# EAGLE design Modem_V3 (EAGLE 7.2.0)
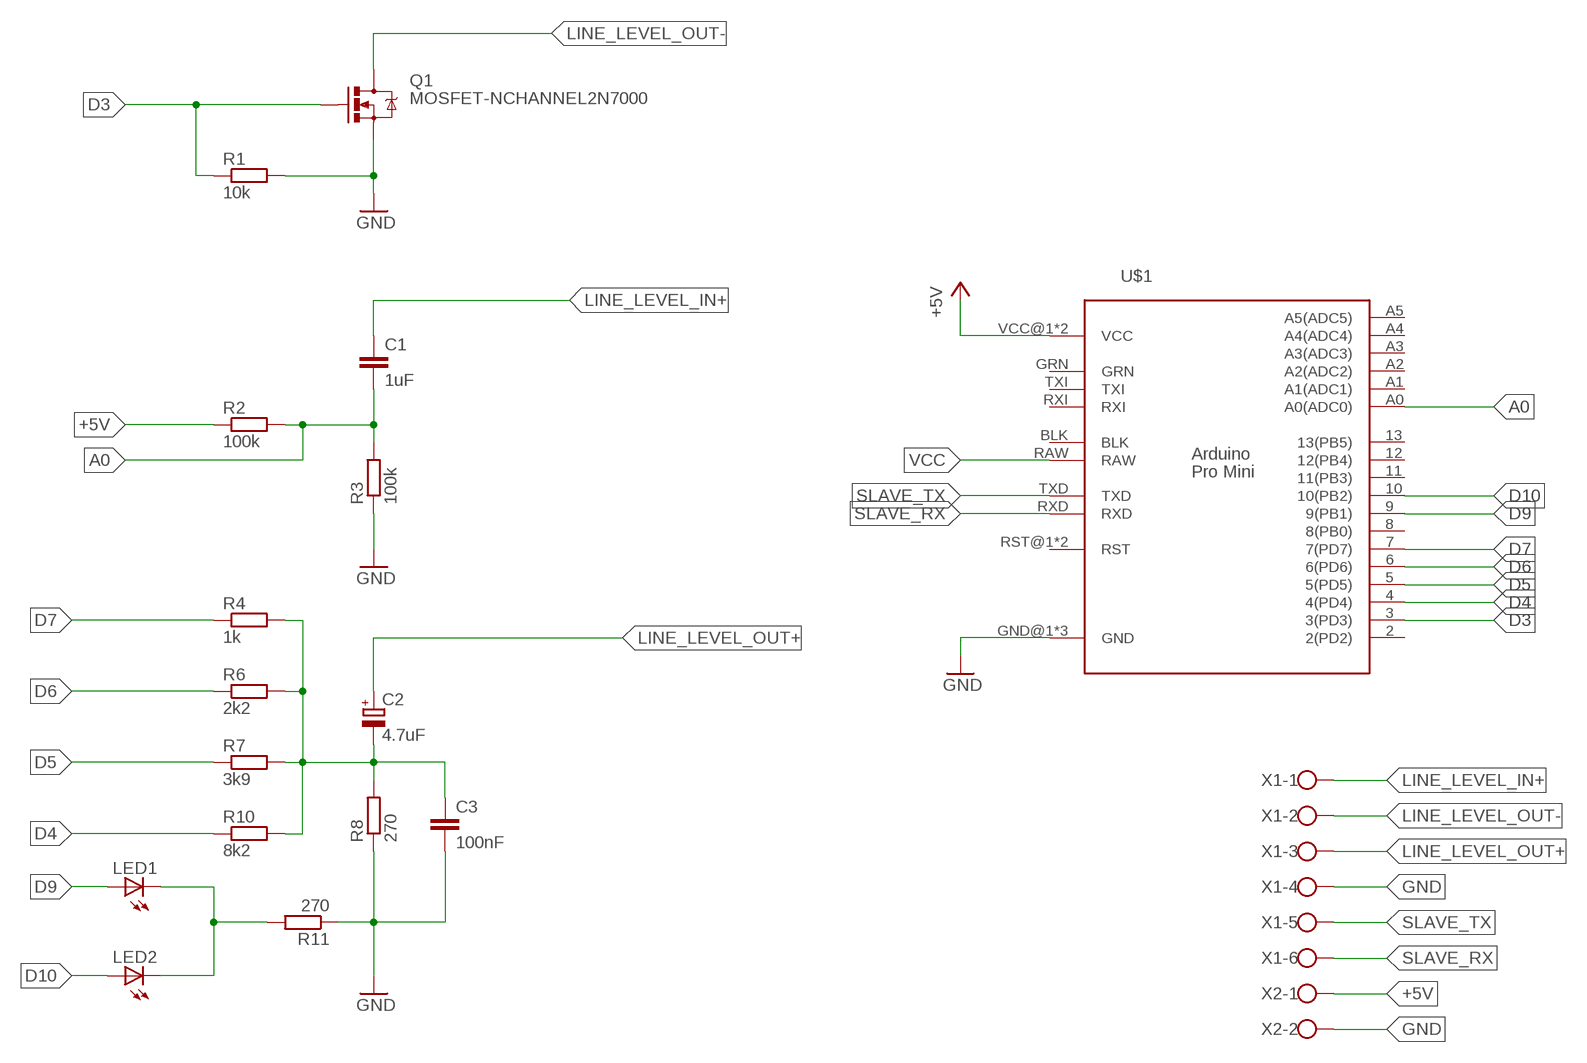
[diagram p0: schematic, sheet 1]

## Parts
C1  1uF  C-EU025-030X050  [C025-030X050]
C2  4.7uF  CPOL-EUE2.5-6  [E2,5-6]
C3  100nF  C-EU025-030X050  [C025-030X050]
LED1  LED5MM  [LED5MM]
LED2  LED5MM  [LED5MM]
Q1  MOSFET-NCHANNEL2N7000  [TO-92]
R1  10k  R-EU_0207/2V  [0207/2V]
R2  100k  R-EU_0207/2V  [0207/2V]
R3  100k  R-EU_0207/2V  [0207/2V]
R4  1k  R-EU_0207/2V  [0207/2V]
R6  2k2  R-EU_0207/2V  [0207/2V]
R7  3k9  R-EU_0207/2V  [0207/2V]
R8  270  R-EU_0207/2V  [0207/2V]
R10  8k2  R-EU_0207/2V  [0207/2V]
R11  270  R-EU_0207/2V  [0207/2V]
U$1  PRO-MINI  [PRO-MINI]
X1  W237-6  [W237-6]
X2  W237-102  [W237-102]

## Nets
+5V: R2.1 U$1.VCC@1(VCC) U$1.VCC@2(VCC) X2.1
A0: C1.2 R2.2 R3.2 U$1.A0(A0(ADC0))
D3: Q1.2(G) R1.1 U$1.3(3(PD3))
D4: R10.1 U$1.4(4(PD4))
D5: R7.1 U$1.5(5(PD5))
D6: R6.1 U$1.6(6(PD6))
D7: R4.1 U$1.7(7(PD7))
D9: LED1.A U$1.9(9(PB1))
D10: LED2.A U$1.10(10(PB2))
GND: C3.2 Q1.1(S) R1.2 R3.1 R8.1 R11.1 U$1.GND@1(GND) U$1.GND@2(GND) U$1.GND@3(GND) X1.4 X2.2
LINE_LEVEL_IN+: C1.1 X1.1
LINE_LEVEL_OUT+: C2.+ X1.3
LINE_LEVEL_OUT-: Q1.3(D) X1.2
N$8: LED1.K(C) LED2.K(C) R11.2
N$9: C2.- C3.1 R4.2 R6.2 R7.2 R8.2 R10.2
SLAVE_RX: U$1.RXD X1.6
SLAVE_TX: U$1.TXD X1.5
VCC: U$1.RAW
Unconnected: U$1.2(2(PD2)) U$1.8(8(PB0)) U$1.11(11(PB3)) U$1.12(12(PB4)) U$1.13(13(PB5)) U$1.A1(A1(ADC1)) U$1.A2(A2(ADC2)) U$1.A3(A3(ADC3)) U$1.A4(A4(ADC4)) U$1.A5(A5(ADC5)) U$1.BLK U$1.GRN U$1.RST@1(RST) U$1.RST@2(RST) U$1.RXI U$1.TXI

## Library data of the parts
C1 C3 = resistor:C-EU: CAPACITOR, European symbol
C2 = resistor:CPOL-EU: POLARIZED CAPACITOR, European symbol
LED1 LED2 = led:LED: LED OSRAM: - CHIPLED LG R971, LG N971, LY N971, LG Q971, LY Q971, LO R971, LY R971 LH N974, LH R974 LS Q976, LO Q976, LY Q976 LO Q996 - Hyper CHIPLED LW Q18S LB Q993, LB Q99A, LB R99A - SideLED LS A670, LO A670, LY A670, LG A670, LP A670 LB A673, LV A673, LT A673, LW A673 LH A674 LY A675 LS A676, LA A676, LO A676, LY A676, LW A676 LS A679, LY A679, LG A679 - Hyper Micro SIDELED® LS Y876, LA Y876, LO Y876, LY Y876 LT Y87S - SmartLED LW L88C, LW L88S LB L89C, LB L89S, LG L890 LS L89K, LO L89K, LY L89K LS L896, LA L896, LO L896, LY L896 - TOPLED LS T670, LO T670, LY T670, LG T670, LP T670 LSG T670, LSP T670, LSY T670, LOP T670, LYG T670 LG T671, LOG T671, LSG T671 LB T673, LV T673, LT T673, LW T673 LH T674 LS T676, LA T676, LO T676, LY T676, LB T676, LH T676, LSB T676, LW T676 LB T67C, LV T67C, LT T67C, LS T67K, LO T67K, LY T67K, LW E67C LS E67B, LA E67B, LO E67B, LY E67B, LB E67C, LV E67C, LT E67C LW T67C LS T679, LY T679, LG T679 LS T770, LO T770, LY T770, LG T770, LP T770 LB T773, LV T773, LT T773, LW T773 LH T774 LS E675, LA E675, LY E675, LS T675 LS T776, LA T776, LO T776, LY T776, LB T776 LHGB T686 LT T68C, LB T68C - Hyper Mini TOPLED® LB M676 - Mini TOPLED Santana® LG M470 LS M47K, LO M47K, LY M47K Source: http://www.osram.convergy.de LUXEON: - LUMILED® LXK2-PW12-R00, LXK2-PW12-S00, LXK2-PW14-U00, LXK2-PW14-V00 LXK2-PM12-R00, LXK2-PM12-S00, LXK2-PM14-U00 LXK2-PE12-Q00, LXK2-PE12-R00, LXK2-PE12-S00, LXK2-PE14-T00, LXK2-PE14-U00 LXK2-PB12-K00, LXK2-PB12-L00, LXK2-PB12-M00, LXK2-PB14-N00, LXK2-PB14-P00, LXK2-PB14-Q00 LXK2-PR12-L00, LXK2-PR12-M00, LXK2-PR14-Q00, LXK2-PR14-R00 LXK2-PD12-Q00, LXK2-PD12-R00, LXK2-PD12-S00 LXK2-PH12-R00, LXK2-PH12-S00 LXK2-PL12-P00, LXK2-PL12-Q00, LXK2-PL12-R00 Source: www.luxeon.com KINGBRIGHT: KA-3528ASYC Source: www.kingbright.com
Q1 = SparkFun-DiscreteSemi:MOSFET-NCHANNEL: Common NMOSFET Parts MFG P/N Store ID Prod ID FDD8780 TRANS-09984 SI7820DN TRANS-11055 FDS6630A IC-08089 2N7002PW TRANS-11151 FQP30N06L COM-10213 TRANS-10060 BSS123LT1G TRANS-08345 BSS138 TRANS-00830 BS170 2N7000
R1-R4 R6-R8 R10 R11 = resistor:R-EU_: RESISTOR, European symbol
U$1 = custom parts:PRO-MINI
X1 = con-wago-500:W237-6: WAGO SCREW CLAMP; OC_FARNELL: unknown; OC_NEWARK: unknown
X2 = con-wago-500:W237-102: WAGO SCREW CLAMP; MPN: 237-102; OC_FARNELL: unknown; OC_NEWARK: 70K9898

## Board
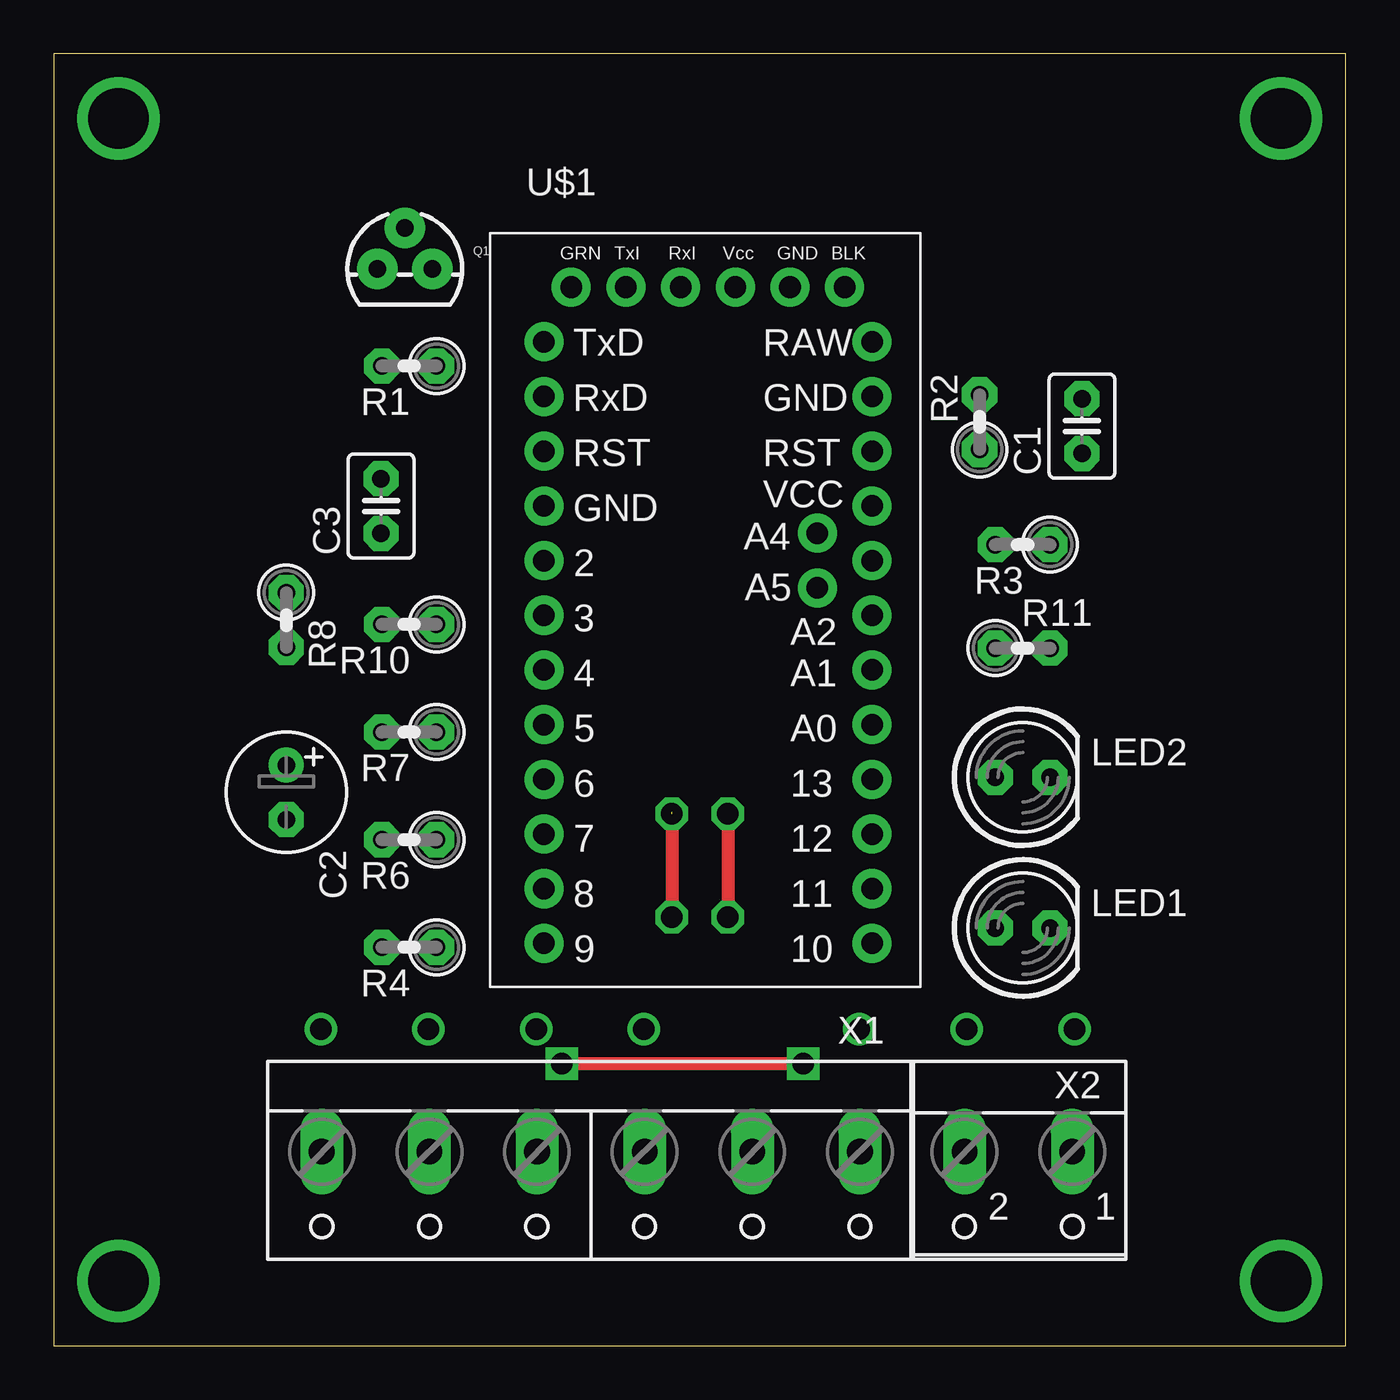
[diagram p1: board, top side]
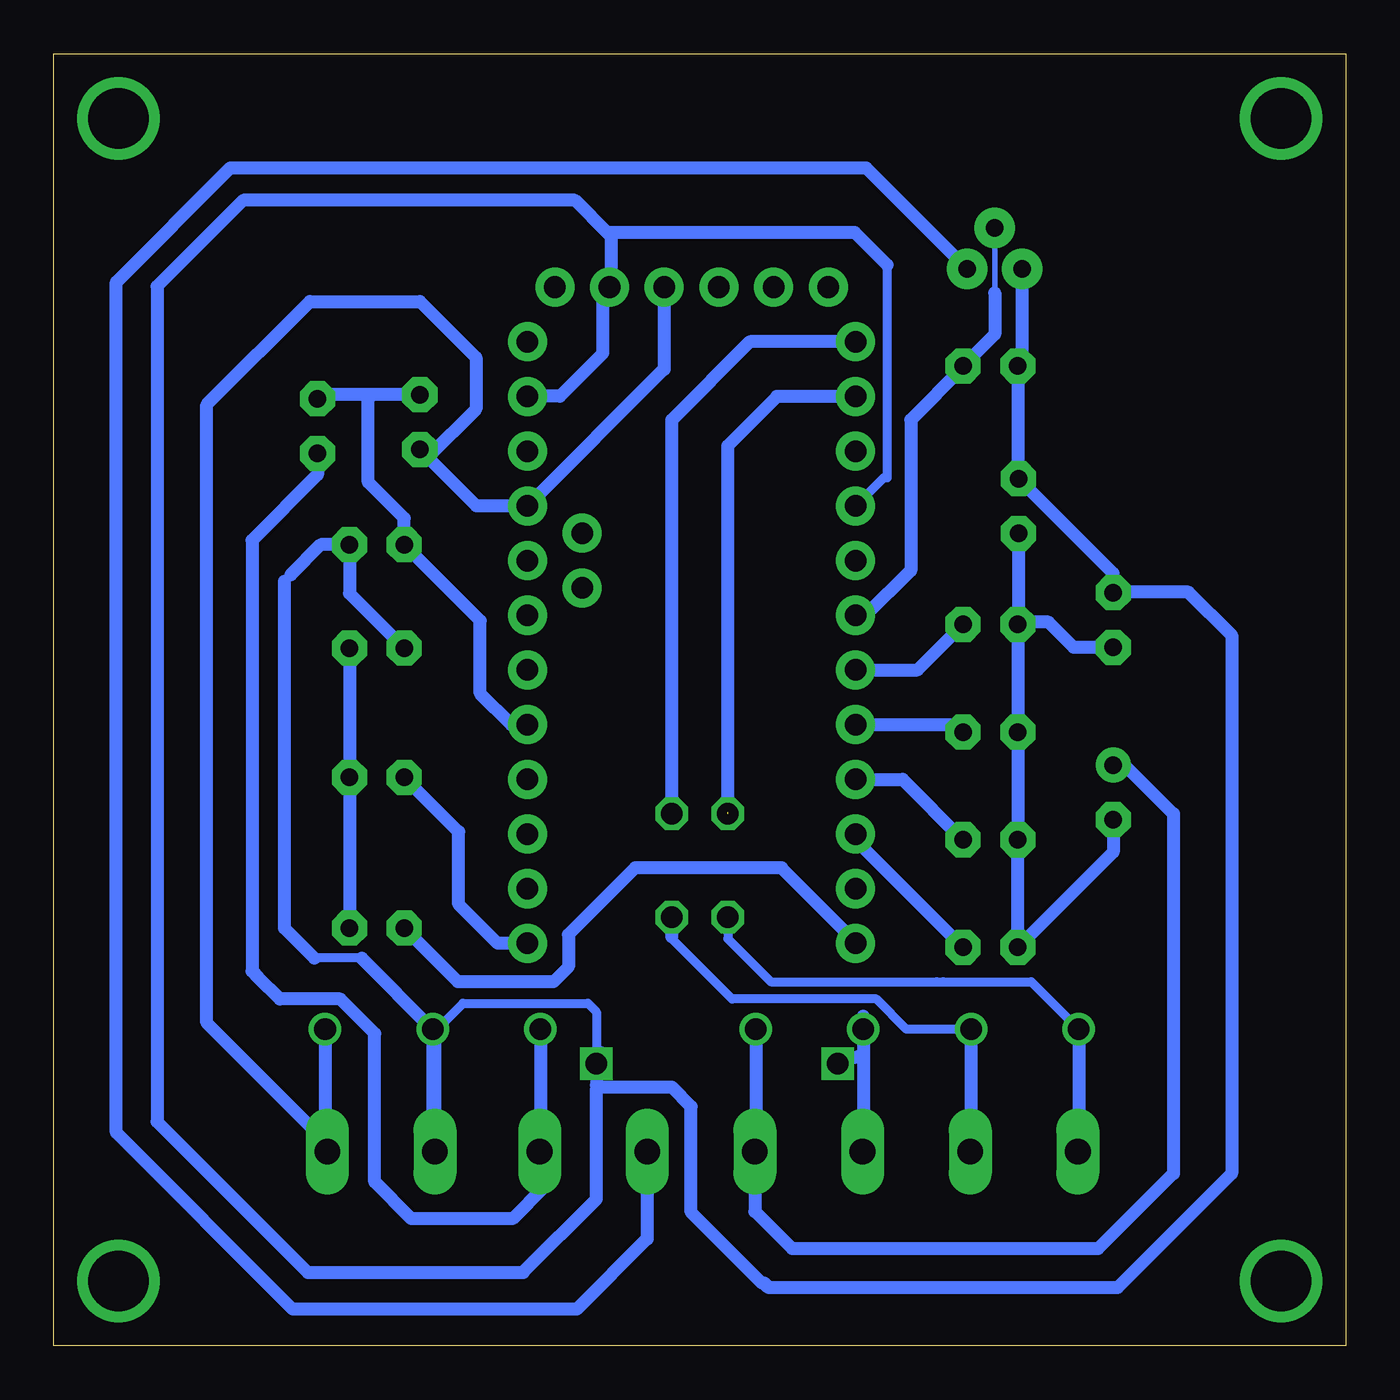
[diagram p2: board, bottom side, seen from below]

Size 60 x 60 mm. Coordinates in mm from the lower left corner, seen from the top.
Outline: 0,0 60,0 60,60 0,60 0,0
Copper layers (1*16): Top 0.035mm / dielectric 1.5mm / Bottom 0.035mm
Design rules "default": minimum track width 10mil, minimum drill 24mil, track to track 8mil, track to pad 8mil, pad to pad 8mil, via to via 8mil, smd to smd 8mil, copper to edge 40mil, drill to drill 8mil, minimum pad ring 16mil, minimum via ring 10mil, stop-mask expansion 4mil, vias tented up to drill 0mil, thermal gap 10mil

### Footprints (pad centres in the part's own frame; a part is rotated, then mirrored left to right if it is on the bottom)
C025-030X050 = drill 0.813 octagon: 1 -1.27,0; 2 1.27,0
E2,5-6 = drill 0.813 pad 1.6: + -1.27,0 | drill 0.813 pad 1.6 octagon: - 1.27,0
LED5MM = drill 0.813 octagon: A -1.27,0; K 1.27,0
TO-92 = drill 0.813 pad 1.88: 1 -1.27,0; 2 0,1.905; 3 1.27,0
0207/2V = drill 0.813 octagon: 1 -1.27,0; 2 1.27,0
PRO-MINI = drill 1: 2 2.48,19.794; 3 2.48,17.254; 4 2.48,14.714; 5 2.48,12.174; 6 2.48,9.634; 7 2.48,7.094; 8 2.48,4.554; 9 2.48,2.014; 10 17.72,2.014; 11 17.72,4.554; 12 17.72,7.094; 13 17.72,9.634; A0 17.72,12.174; A1 17.72,14.714; A2 17.72,17.254; A3 17.72,19.794; A4 15.18,21.064; A5 15.18,18.524; BLK 16.45,32.494; GND@1 2.48,22.334; GND@2 17.72,27.414; GND@3 13.91,32.494; GRN 3.75,32.494; RAW 17.72,29.954; RST@1 2.48,24.874; RST@2 17.72,24.874; RXD 2.48,27.414; RXI 8.83,32.494; TXD 2.48,29.954; TXI 6.29,32.494; VCC@1 17.72,22.334; VCC@2 11.37,32.494
W237-6 = drill 1.194 long: 1 -12.5,-1.27; 2 -7.5,-1.27; 3 -2.5,-1.27; 4 2.5,-1.27; 5 7.5,-1.27; 6 12.5,-1.27
W237-102 = drill 1.194 long: 1 -2.5,-1.27; 2 2.5,-1.27

### Placement (x,y rotation side)
C1  47.75,42.71 90 top
C2  10.8,25.7 270 top
C3  15.2,39 90 top
LED1  45,19.4 0 top
LED2  45,26.4 0 top
Q1  16.3,50 0 top
R1  16.5,45.5 180 top
R2  43,42.9 90 top
R3  45,37.2 180 top
R4  16.5,18.5 180 top
R6  16.5,23.5 180 top
R7  16.5,28.5 180 top
R8  10.8,33.7 270 top
R10  16.5,33.5 180 top
R11  45,32.4 0 top
U$1  20.28,16.67 0 top
X1  24.94,7.74 180 top
X2  44.8,7.74 180 top

### Tracks (layer width: path | path; a pad name or v marks a point on that pad's centre or on a via)
+5V  (via drill 1)
  Bottom 0.61: 42.63,41.27 40.37,39 U$1.VCC@1 31.65,45.35 U$1.VCC@2 | 42.63,41.27 R2.1 | 42.63,41.27 40.4,43.5 40.4,45.9 43,48.5 48.1,48.5 52.9,43.7 52.9,15 47.3,9.4 X2.1 47.4,9.11 v47.4,14.7
A0
  Bottom 0.61: U$1.A0 38.74,28.84 40.2,30.3 40.2,33.67 R3.2 43.73,38.43 45.4,40.1 45.4,43.97 45.2,44.17 | R2.2 45.2,44.17 | 45.2,44.17 47.56,44.17 C1.2
D3
  Bottom 0.254: Q1.2 16.3,48.9
  Bottom 0.61: U$1.3 22.28,33.92 20.2,36 20.2,43 17.77,45.43 R1.1 16.3,46.97 16.3,48.9
D4
  Bottom 0.61: U$1.4 19.89,31.38 R10.1
D5
  Bottom 0.61: U$1.5 18.11,28.84 R7.1
D6
  Bottom 0.61: U$1.6 20.57,26.3 R6.1
D7
  Bottom 0.61: U$1.7 22.76,23.49 R4.1
D9
  Bottom 0.61: U$1.9 22.76,18.76 26.2,22.2 33,22.2 36.1,19.1 36.1,17.6 36.8,16.9 41.23,16.9 LED1.A
D10
  Bottom 0.61: U$1.10 39.38,18.68 41.2,20.5 41.2,23.87 LED2.A
GND  (via drill 1)
  Top 0.61: v34.8,13.1 v23.6,13.1
  Bottom 0.406: 47.6,37.2 49.3,35.5 | 45.7,18 47.9,18 | 21.3,50.2 21.3,40.3 21.46,40.3 U$1.GND@1 | v42.4,14.7 42.2,14.7 41,15.9 35.2,15.9 34.8,15.5 34.8,13.8 34.6,13.6
  Bottom 0.61: Q1.1 15.03,45.7 R1.2 15.23,40.3 C3.2 10.8,35.87 R8.1 10.77,35 7.3,35 5.3,33 5.3,8 10.6,2.7 26.8,2.7 27,2.9 27.1,2.9 30.4,6.2 30.4,11.1 31.3,12 34.7,12 | X1.4 22.44,9.5 | 22.44,9.5 22.44,10.54 | 34.2,49.17 U$1.GND@3 34.5,48.85 34.5,48.8 | R11.1 46.27,34.94 R3.1 47.6,37.2 49,35.8 | 22.4,13.6 v22.4,14.7 22.4,15.3 | 22.4,13.6 22.4,9.54 22.44,9.5 | 34.5,48.8 34.5,46.1 36.5,44.1 37.98,44.1 U$1.GND@2 | 34.5,48.8 34.1,49.2 34.1,51.5 34.25,51.65 | 34.25,51.65 35.8,53.2 51.2,53.2 55.2,49.2 55.2,10.4 48.2,3.4 38.2,3.4 34.8,6.8 34.8,11.9 34.7,12 | 21.3,50.2 22.8,51.7 34.2,51.7 34.25,51.65 | 47.9,18 49.3,19.4 49.3,35.5 | 45.7,18 v42.4,14.7 42.4,9.11 X2.2 42.3,14.3 | 34.6,13.6 v34.8,13.1 34.8,12.1 34.7,12 | v23.6,13.1 22.5,13.5 22.4,13.6
LINE_LEVEL_IN+  (via drill 1)
  Bottom 0.61: C1.1 47.75,40.45 50.8,37.4 50.8,17.4 50.5,17.1 49.5,16.1 46.7,16.1 45.1,14.5 45.1,7.6 43.4,5.9 38.7,5.9 37.2,7.4 37.44,7.64 X1.1 37.4,9.05 v37.4,14.7
LINE_LEVEL_OUT+  (via drill 1)
  Bottom 0.61: X1.3 27.44,8.5 | 27.44,8.5 27.44,6.24 25.7,4.5 11.5,4.5 8,8 8,24.7 10.27,26.97 C2.+ | v27.4,14.7 27.4,8.54 27.44,8.5
LINE_LEVEL_OUT-
  Bottom 0.61: X1.2 32.44,4.96 35.7,1.7 48.9,1.7 57.1,9.9 57.1,49.4 51.8,54.7 22.27,54.7 Q1.3
N$1  (via drill 2.8)
  other vias: 3,3
N$2  (via drill 2.8)
  other vias: 3,57
N$3  (via drill 2.8)
  other vias: 57,57
N$4  (via drill 2.8)
  other vias: 57,3
N$8
  Bottom 0.61: LED1.K LED2.K R11.2
N$9
  Bottom 0.61: R10.2 R7.2 R6.2 R4.2 10.8,22.93 C2.- | R8.2 12.63,32.43 13.8,33.6 15.13,33.6 R10.2 | C3.1 15.2,33.53 R10.2
SLAVE_RX  (via drill 1)  (1 unrouted)
  Top 0.61: v28.7,24.7 v28.7,19.9
  Bottom 0.305: 19,16.9 19.2,16.9
  Bottom 0.406: 28.7,19.8 v28.7,19.9 28.7,18.9 26.7,16.9 19,16.9 18.7,16.9 14.6,16.9 v12.4,14.7
  Bottom 0.61: U$1.RXD 26.42,44.08 28.7,41.8 28.7,24.8 | v12.4,14.7 12.4,9.05 X1.6
SLAVE_TX  (via drill 1)
  Top 0.61: v31.3,24.7 v31.3,19.9
  Bottom 0.406: 31.3,19 31.3,18.9 28.5,16.1 21.8,16.1 20.4,14.7 v17.4,14.7
  Bottom 0.61: U$1.TXD 27.68,46.62 31.3,43 v31.3,24.7 | 31.3,19 v31.3,19.9 | v17.4,14.7 17.4,9.05 X1.5

### Text on the board
tValues: SVTrackR by APRS Studio | Rx | Tx | M- | S+ | S- | M+ | +5V | GND